# EAGLE design Flipper-Proto (EAGLE 7.7.0)
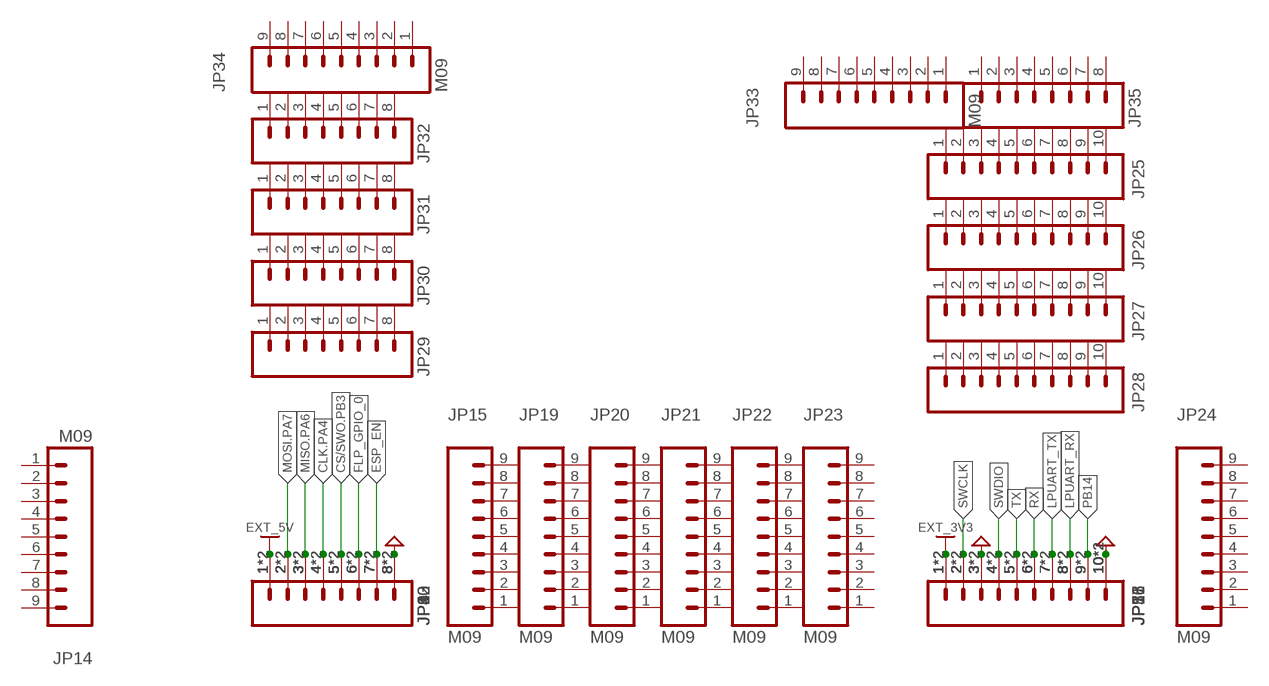
[diagram p0: schematic, sheet 1]

## Parts
JP1  M10"  [1X10]
JP2  M08SMD-COMBO  [1X08_SMD_COMBINED]
JP3  M08SMD-COMBO  [1X08_SMD_COMBINED]
JP4  M08SMD-COMBO  [1X08_SMD_COMBINED]
JP5  M10COMBINED  [1X10_SMD_COMBINED]
JP6  M081X08  [1X08]
JP7  M10COMBINED  [1X10_SMD_COMBINED]
JP8  M10COMBINED  [1X10_SMD_COMBINED]
JP9  M081X08  [1X08]
JP10  M081X08  [1X08]
JP11  M10"  [1X10]
JP12  M081X08  [1X08]
JP13  M081X08  [1X08]
JP14  M09  [1X09]
JP15  M09  [1X09]
JP16  M10"  [1X10]
JP17  M10"  [1X10]
JP18  M10"  [1X10]
JP19  M09  [1X09]
JP20  M09  [1X09]
JP21  M09  [1X09]
JP22  M09  [1X09]
JP23  M09  [1X09]
JP24  M09  [1X09]
JP25  M10"  [1X10]
JP26  M10"  [1X10]
JP27  M10"  [1X10]
JP28  M10"  [1X10]
JP29  M081X08  [1X08]
JP30  M081X08  [1X08]
JP31  M081X08  [1X08]
JP32  M081X08  [1X08]
JP33  M09  [1X09]
JP34  M09  [1X09]
JP35  M081X08  [1X08]

## Nets
CLK.PA4: JP2.4 JP2.4@2 JP3.4 JP3.4@2 JP4.4 JP4.4@2 JP6.4 JP9.4 JP10.4 JP12.4 JP13.4
CS/SWO.PB3: JP2.5 JP2.5@2 JP3.5 JP3.5@2 JP4.5 JP4.5@2 JP6.5 JP9.5 JP10.5 JP12.5 JP13.5
ESP_EN: JP2.7 JP2.7@2 JP3.7 JP3.7@2 JP4.7 JP4.7@2 JP6.7 JP9.7 JP10.7 JP12.7 JP13.7
EXT_3V3: JP1.1 JP5.1 JP5.1@2 JP7.1 JP7.1@2 JP8.1 JP8.1@2 JP11.1 JP16.1 JP17.1 JP18.1
EXT_5V: JP2.1 JP2.1@2 JP3.1 JP3.1@2 JP4.1 JP4.1@2 JP6.1 JP9.1 JP10.1 JP12.1 JP13.1
FLP_GPIO_0: JP2.6 JP2.6@2 JP3.6 JP3.6@2 JP4.6 JP4.6@2 JP6.6 JP9.6 JP10.6 JP12.6 JP13.6
GND: JP1.3 JP1.10 JP2.8 JP2.8@2 JP3.8 JP3.8@2 JP4.8 JP4.8@2 JP5.3 JP5.3@2 JP5.10 JP5.10@2 JP6.8 JP7.3 JP7.3@2 JP7.10 JP7.10@2 JP8.3 JP8.3@2 JP8.10 JP8.10@2 JP9.8 JP10.8 JP11.3 JP11.10 JP12.8 JP13.8 JP16.3 JP16.10 JP17.3 JP17.10 JP18.3 JP18.10
LPUART_RX: JP1.8 JP5.8 JP5.8@2 JP7.8 JP7.8@2 JP8.8 JP8.8@2 JP11.8 JP16.8 JP17.8 JP18.8
LPUART_TX: JP1.7 JP5.7 JP5.7@2 JP7.7 JP7.7@2 JP8.7 JP8.7@2 JP11.7 JP16.7 JP17.7 JP18.7
MISO.PA6: JP2.3 JP2.3@2 JP3.3 JP3.3@2 JP4.3 JP4.3@2 JP6.3 JP9.3 JP10.3 JP12.3 JP13.3
MOSI.PA7: JP2.2 JP2.2@2 JP3.2 JP3.2@2 JP4.2 JP4.2@2 JP6.2 JP9.2 JP10.2 JP12.2 JP13.2
PB14: JP1.9 JP5.9 JP5.9@2 JP7.9 JP7.9@2 JP8.9 JP8.9@2 JP11.9 JP16.9 JP17.9 JP18.9
RX: JP1.6 JP5.6 JP5.6@2 JP7.6 JP7.6@2 JP8.6 JP8.6@2 JP11.6 JP16.6 JP17.6 JP18.6
SWCLK: JP1.2 JP5.2 JP5.2@2 JP7.2 JP7.2@2 JP8.2 JP8.2@2 JP11.2 JP16.2 JP17.2 JP18.2
SWDIO: JP1.4 JP5.4 JP5.4@2 JP7.4 JP7.4@2 JP8.4 JP8.4@2 JP11.4 JP16.4 JP17.4 JP18.4
TX: JP1.5 JP5.5 JP5.5@2 JP7.5 JP7.5@2 JP8.5 JP8.5@2 JP11.5 JP16.5 JP17.5 JP18.5
Unconnected: JP14.1 JP14.2 JP14.3 JP14.4 JP14.5 JP14.6 JP14.7 JP14.8 JP14.9 JP15.1 JP15.2 JP15.3 JP15.4 JP15.5 JP15.6 JP15.7 JP15.8 JP15.9 JP19.1 JP19.2 JP19.3 JP19.4 JP19.5 JP19.6 JP19.7 JP19.8 JP19.9 JP20.1 JP20.2 JP20.3 JP20.4 JP20.5 JP20.6 JP20.7 JP20.8 JP20.9 JP21.1 JP21.2 JP21.3 JP21.4 JP21.5 JP21.6 JP21.7 JP21.8 JP21.9 JP22.1 JP22.2 JP22.3 JP22.4 JP22.5 JP22.6 JP22.7 JP22.8 JP22.9 JP23.1 JP23.2 JP23.3 JP23.4 JP23.5 JP23.6 JP23.7 JP23.8 JP23.9 JP24.1 JP24.2 JP24.3 JP24.4 JP24.5 JP24.6 JP24.7 JP24.8 JP24.9 JP25.1 JP25.2 JP25.3 JP25.4 JP25.5 JP25.6 JP25.7 JP25.8 JP25.9 JP25.10 JP26.1 JP26.2 JP26.3 JP26.4 JP26.5 JP26.6 JP26.7 JP26.8 JP26.9 JP26.10 JP27.1 JP27.2 JP27.3 JP27.4 JP27.5 JP27.6 JP27.7 JP27.8 JP27.9 JP27.10 JP28.1 JP28.2 JP28.3 JP28.4 JP28.5 JP28.6 JP28.7 JP28.8 JP28.9 JP28.10 JP29.1 JP29.2 JP29.3 JP29.4 JP29.5 JP29.6 JP29.7 JP29.8 JP30.1 JP30.2 JP30.3 JP30.4 JP30.5 JP30.6 JP30.7 JP30.8 JP31.1 JP31.2 JP31.3 JP31.4 JP31.5 JP31.6 JP31.7 JP31.8 JP32.1 JP32.2 JP32.3 JP32.4 JP32.5 JP32.6 JP32.7 JP32.8 JP33.1 JP33.2 JP33.3 JP33.4 JP33.5 JP33.6 JP33.7 JP33.8 JP33.9 JP34.1 JP34.2 JP34.3 JP34.4 JP34.5 JP34.6 JP34.7 JP34.8 JP34.9 JP35.1 JP35.2 JP35.3 JP35.4 JP35.5 JP35.6 JP35.7 JP35.8

## Library data of the parts
JP1 JP5 JP7 JP8 JP11 JP16-JP18 JP25-JP28 = SparkFun-Connectors:M10: Header 10 Standard 10-pin 0.1" header. Use with straight break away headers (SKU : PRT-00116), right angle break away headers (PRT-00553), swiss pins (PRT-00743), machine pins (PRT-00117), and female headers (PRT-00115).
JP2-JP4 JP6 JP9 JP10 JP12 JP13 JP29-JP32 JP35 = SparkFun-Connectors:M08: Header 8 Standard 8-pin 0.1" header. Use with straight break away headers (SKU : PRT-00116), right angle break away headers (PRT-00553), swiss pins (PRT-00743), machine pins (PRT-00117), and female headers (PRT-00115).
JP14 JP15 JP19-JP24 JP33 JP34 = SparkFun-Connectors:M09: Header 9 Standard 9-pin 0.1" header. Use with straight break away headers (SKU : PRT-00116), right angle break away headers (PRT-00553), swiss pins (PRT-00743), machine pins (PRT-00117), and female headers (PRT-00115).

## Board
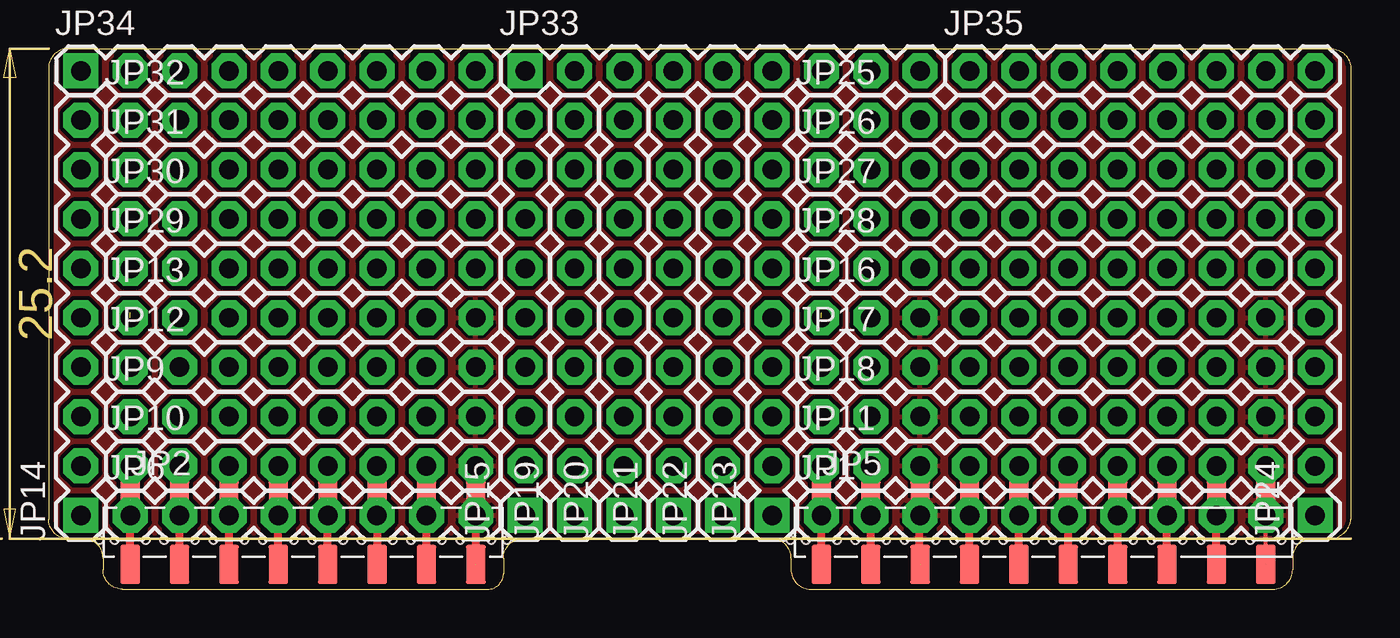
[diagram p1: board, top side]
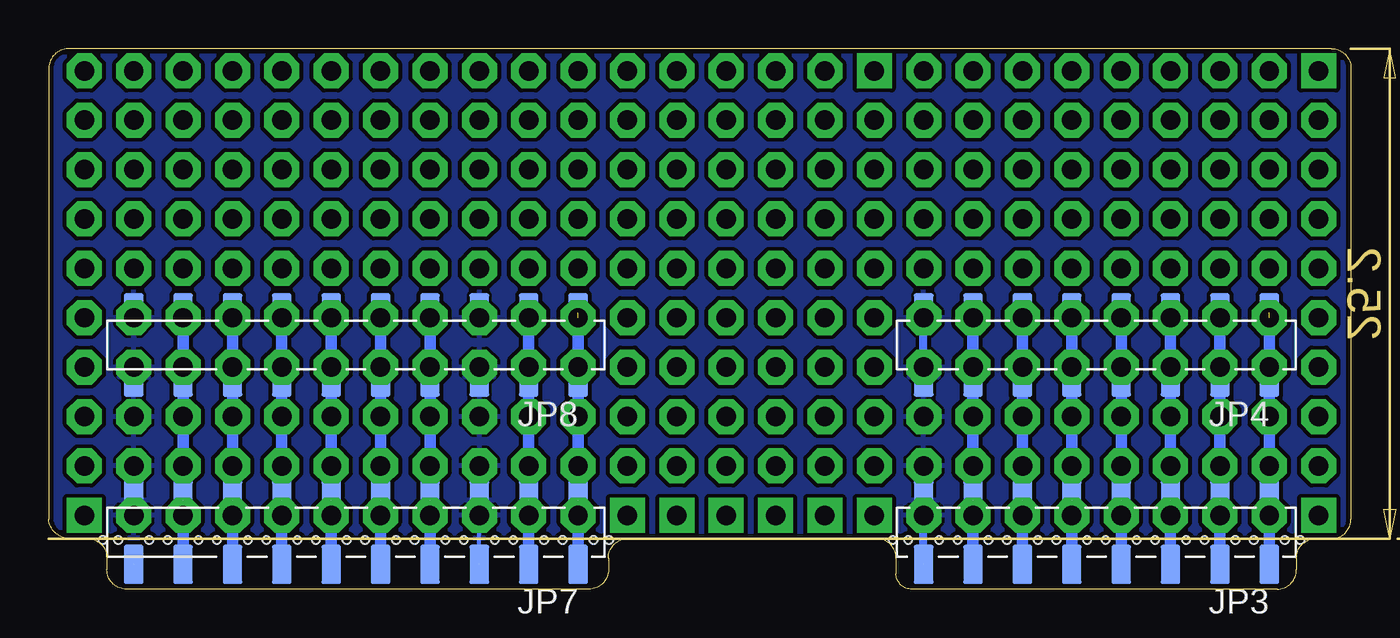
[diagram p2: board, bottom side, seen from below]

Size 67 x 27.8 mm. Coordinates in mm from the lower left corner, seen from the top.
Outline: 3.8,0 22.6,0 arc90 23.4,0.8 23.4,1.6 arc-90 24.4,2.6 37.2,2.6 arc-90 38.2,1.6 38.2,1 arc90 39.2,0 63,0 arc90 64,1 64,1.6 arc-90 65,2.6 65.8,2.6 arc90 67,3.6 67,26.8 arc90 65.9,27.8 1,27.8 arc90 0,26.8 0,3.6 arc90 1,2.6 1.8,2.6 arc-90 2.8,1.6 2.8,1 arc90 3.8,0
Copper layers (1*16): Top 0.018mm / dielectric 0.8mm / Bottom 0.018mm
Design rules "Rezonit-020-020 *": minimum track width 0.2mm, minimum drill 0.3mm, track to track 0.2mm, track to pad 0.2mm, pad to pad 0.2mm, via to via 0.2mm, smd to smd 0mil, copper to edge 0.25mm, drill to drill 0.3mm, minimum pad ring 0.2mm, minimum via ring 0.2mm, stop-mask expansion 4mil, vias tented up to drill 0.4mm, thermal gap 0.15mm
Holes 0.4 mm at 7.53,2.53 11.03,2.53 12.61,2.53 15.15,2.53 17.69,2.53 20.23,2.53 22.77,2.53 38.97,2.53 41.51,2.53 54.21,2.53 51.67,2.53 49.13,2.53 46.59,2.53 44.05,2.53 56.75,2.53 59.29,2.53 61.83,2.53 63.41,2.53 55.79,2.53 4.99,2.53 5.95,2.53 3.41,2.53 8.49,2.53 10.07,2.53 13.57,2.53 16.11,2.53 18.65,2.53 21.19,2.53 40.55,2.53 43.09,2.53 45.63,2.53 48.17,2.53 50.71,2.53 53.25,2.53 60.87,2.53 58.33,2.53 2.61,2.53 23.57,2.53 64.21,2.53 38.17,2.53
Milling: area -2.3,26.3 to -1.7,27.8; area -2.3,2.6 to -1.7,4.1; area -1.6,12.4 to 0.2,18; area -4.1,0 to -3.5,1.5; area -4.1,1.1 to -3.5,2.6; area -6,-0.8 to -4.2,3.4; 7 lines

### Footprints (pad centres in the part's own frame; a part is rotated, then mirrored left to right if it is on the bottom)
1X10 = drill 1 pad 1.8 octagon: 1 0,0; 2 2.54,0; 3 5.08,0; 4 7.62,0; 5 10.16,0; 6 12.7,0; 7 15.24,0; 8 17.78,0; 9 20.32,0; 10 22.86,0
1X08_SMD_COMBINED = smd 1 x 2: 1 0,1.65; 1@2 0,-1.65; 2 2.54,-1.65; 2@2 2.54,1.65; 3 5.08,1.65; 3@2 5.08,-1.65; 4 7.62,-1.65; 4@2 7.62,1.65; 5 10.16,1.65; 5@2 10.16,-1.65; 6 12.7,-1.65; 6@2 12.7,1.65; 7 15.24,1.65; 7@2 15.24,-1.65; 8 17.78,-1.65; 8@2 17.78,1.65
1X10_SMD_COMBINED = smd 1 x 2: 1 0,1.65; 1@2 0,-1.65; 2 2.54,-1.65; 2@2 2.54,1.65; 3 5.08,1.65; 3@2 5.08,-1.65; 4 7.62,-1.65; 4@2 7.62,1.65; 5 10.16,1.65; 5@2 10.16,-1.65; 6 12.7,-1.65; 6@2 12.7,1.65; 7 15.24,1.65; 7@2 15.24,-1.65; 8 17.78,-1.65; 8@2 17.78,1.65; 9 20.32,-1.65; 9@2 20.32,1.65; 10 22.86,-1.65; 10@2 22.86,1.65
1X08 = drill 1 pad 1.8 octagon: 1 0,0; 2 2.54,0; 3 5.08,0; 4 7.62,0; 5 10.16,0; 6 12.7,0; 7 15.24,0; 8 17.78,0
1X09 = drill 1 pad 1.8 square: 1 0,0 | drill 1 pad 1.8 octagon: 2 2.54,0; 3 5.08,0; 4 7.62,0; 5 10.16,0; 6 12.7,0; 7 15.24,0; 8 17.78,0; 9 20.32,0

### Placement (x,y rotation side)
JP1  39.76,3.8 0 top
JP2  4.2,2.93 0 top
JP3  4.2,2.93 180 bottom
JP4  4.2,12.56 180 bottom
JP5  39.76,2.93 0 top
JP6  4.2,3.8 0 top
JP7  39.76,2.93 180 bottom
JP8  39.76,12.56 180 bottom
JP9  4.2,8.88 0 top
JP10  4.2,6.34 0 top
JP11  39.76,6.34 0 top
JP12  4.2,11.42 0 top
JP13  4.2,13.96 0 top
JP14  1.66,3.8 90 top
JP15  24.52,3.8 90 top
JP16  39.76,13.96 0 top
JP17  39.76,11.42 0 top
JP18  39.76,8.88 0 top
JP19  27.06,3.8 90 top
JP20  29.6,3.8 90 top
JP21  32.14,3.8 90 top
JP22  34.68,3.8 90 top
JP23  37.22,3.8 90 top
JP24  65.16,3.8 90 top
JP25  39.76,24.12 0 top
JP26  39.76,21.58 0 top
JP27  39.76,19.04 0 top
JP28  39.76,16.5 0 top
JP29  4.2,16.5 0 top
JP30  4.2,19.04 0 top
JP31  4.2,21.58 0 top
JP32  4.2,24.12 0 top
JP33  24.52,26.66 0 top
JP34  1.66,26.66 0 top
JP35  47.38,26.66 0 top

### Tracks (layer width: path | path; a pad name or v marks a point on that pad's centre or on a via)
CLK.PA4  (1 unrouted)
  Top 0.4: JP3.4@2 JP6.4
  Bottom 0.2: JP6.4 JP2.4@2 JP10.4 | JP13.4 JP4.4
  Bottom 0.6: JP13.4 JP12.4 JP4.4@2 JP9.4 JP10.4 JP6.4 JP3.4@2
CS/SWO.PB3  (1 unrouted)
  Top 0.2: JP3.5@2 JP6.5
  Top 0.4: JP2.5@2 JP3.5@2
  Bottom 0.2: JP2.5@2 JP6.5 JP10.5 JP9.5 JP4.5
  Bottom 0.4: JP13.5 JP4.5@2
  Bottom 0.6: JP13.5 JP12.5 JP9.5 JP2.5@2
ESP_EN  (1 unrouted)
  Top 0.2: JP3.7@2 JP6.7
  Top 0.4: JP2.7@2 JP3.7@2
  Bottom 0.2: JP2.7@2 JP6.7 JP10.7 JP9.7 JP4.7
  Bottom 0.4: JP13.7 JP4.7@2
  Bottom 0.6: JP13.7 JP12.7 JP9.7 JP2.7@2
EXT_3V3  (2 unrouted)
  Top 0.2: JP7.1@2 JP1.1
  Top 0.4: JP5.1@2 JP7.1@2
  Top 0.6: JP7.1@2 JP11.1
  Bottom 0.2: JP5.1@2 JP1.1 | JP11.1 JP18.1 JP8.1
  Bottom 0.6: JP16.1 JP17.1 JP18.1 JP5.1@2
EXT_5V  (2 unrouted)
  Top 0.2: JP3.1@2 JP6.1
  Top 0.4: JP2.1@2 JP6.1
  Bottom 0.2: JP2.1@2 JP6.1 JP10.1
  Bottom 0.6: JP10.1 JP9.1 | JP9.1 JP4.1 | JP13.1 JP12.1 JP9.1 | JP9.1 JP2.1@2
FLP_GPIO_0  (1 unrouted)
  Top 0.2: JP6.6 16.9,4.18
  Top 0.4: JP6.6 JP3.6@2
  Bottom 0.2: JP6.6 JP2.6@2 JP10.6 JP9.6 | JP13.6 JP4.6
  Bottom 0.6: JP13.6 JP12.6 JP4.6@2 | JP6.6 JP9.6 JP4.6@2 | JP3.6@2 JP6.6 | JP4.6@2 JP6.6
GND  (3 unrouted)
  Top 0.2: JP7.10@2 JP1.10 | JP3.8@2 JP6.8
  Top 0.4: JP5.3@2 44.8,1.28 44.8,4.6
  Bottom 0.2: JP5.3@2 JP1.3
  pour Top: 0,2.6 67,2.6 67,27.8 0,27.8
  pour Bottom: 0,2.6 67,2.6 67,27.8 0,27.8
LPUART_RX  (1 unrouted)
  Top 0.4: JP7.8@2 JP1.8
  Bottom 0.2: JP1.8 JP5.8@2 JP11.8 JP18.8 | JP16.8 JP8.8
  Bottom 0.6: JP7.8@2 JP1.8 JP18.8 JP8.8@2 JP17.8 JP16.8
LPUART_TX  (1 unrouted)
  Top 0.2: JP7.7@2 JP1.7
  Top 0.4: JP5.7@2 JP7.7@2
  Bottom 0.2: JP5.7@2 JP1.7 JP11.7 JP18.7 JP8.7
  Bottom 0.4: JP8.7@2 JP16.7
  Bottom 0.6: JP16.7 JP17.7 JP18.7 JP5.7@2
MISO.PA6  (1 unrouted)
  Top 0.2: JP3.3@2 JP6.3
  Top 0.4: JP2.3@2 JP3.3@2
  Bottom 0.2: JP2.3@2 JP6.3 JP10.3 JP9.3 JP4.3
  Bottom 0.4: JP13.3 JP4.3@2
  Bottom 0.6: JP13.3 JP12.3 JP9.3 JP2.3@2
MOSI.PA7  (1 unrouted)
  Top 0.4: JP3.2@2 JP6.2
  Bottom 0.2: JP6.2 JP2.2@2 JP10.2 JP9.2 | JP13.2 JP4.2
  Bottom 0.6: JP3.2@2 JP6.2 JP9.2 JP4.2@2 JP12.2 JP13.2
PB14  (1 unrouted)
  Top 0.2: JP1.9 JP11.9
  Top 0.4: JP7.9@2 JP1.9
  Bottom 0.2: JP5.9@2 JP1.9 | JP11.9 JP18.9 | JP16.9 JP8.9
  Bottom 0.6: JP7.9@2 JP1.9 JP18.9 JP8.9@2 JP17.9 JP16.9
RX  (1 unrouted)
  Top 0.2: JP1.6 JP11.6
  Top 0.4: JP7.6@2 JP1.6
  Bottom 0.2: JP5.6@2 JP1.6 | JP11.6 JP18.6 | JP16.6 JP8.6
  Bottom 0.6: JP7.6@2 JP1.6 JP18.6 JP8.6@2 JP17.6 JP16.6
SWCLK  (1 unrouted)
  Top 0.4: JP7.2@2 JP1.2
  Bottom 0.2: JP1.2 JP5.2@2 JP11.2 JP18.2 | JP16.2 JP8.2
  Bottom 0.6: JP7.2@2 JP1.2 JP18.2 JP8.2@2 JP17.2 JP16.2
SWDIO  (1 unrouted)
  Top 0.4: JP7.4@2 JP1.4
  Bottom 0.2: JP1.4 JP5.4@2 JP11.4 JP18.4 | JP16.4 JP8.4
  Bottom 0.6: JP7.4@2 JP1.4 JP18.4 JP8.4@2 JP17.4 JP16.4
TX  (1 unrouted)
  Top 0.2: JP11.5 JP7.5@2 JP1.5
  Top 0.4: JP5.5@2 JP7.5@2
  Bottom 0.2: JP5.5@2 JP1.5 | JP11.5 JP18.5 JP8.5
  Bottom 0.4: JP8.5@2 JP16.5
  Bottom 0.6: JP16.5 JP17.5 JP18.5 JP5.5@2